# Altium schematic sheet DDS.SchDoc
size A; SheetNumber: 5; SheetTotal: 12
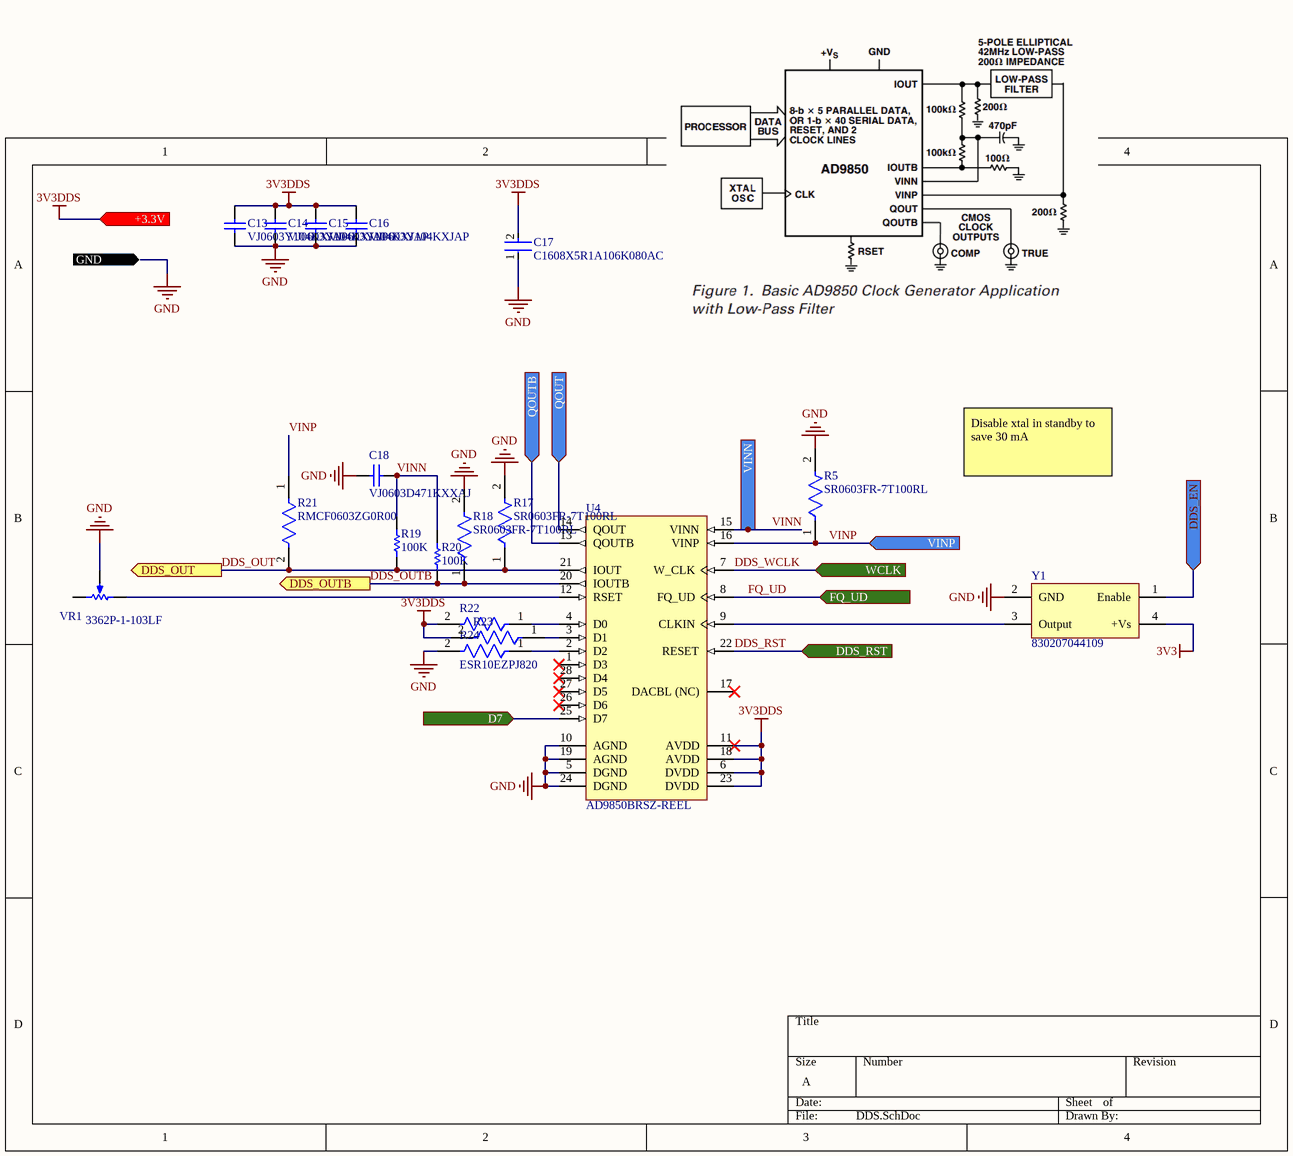
[diagram p0: DDS.SchDoc]

## Parts
C13  VJ0603Y104KXJAP  [CAPC1608X92X38NL15T08]
C14  VJ0603Y104KXJAP  [CAPC1608X92X38NL15T08]
C15  VJ0603Y104KXJAP  [CAPC1608X92X38NL15T08]
C16  VJ0603Y104KXJAP  [CAPC1608X92X38NL15T08]
C17  C1608X5R1A106K080AC  [FP-C1608-080-0_1-MFG]
C18  VJ0603D471KXXAJ  [CAPC1608X92X38LL15T08]
R5  SR0603FR-7T100RL  [FP-SR0603-MFG]
R17  SR0603FR-7T100RL  [FP-SR0603-MFG]
R18  SR0603FR-7T100RL  [FP-SR0603-MFG]
R19  100K  [RESC0603(1608)_N]
R20  100K  [RESC0603(1608)_N]
R21  RMCF0603ZG0R00  [FP-RMCF0603-IPC_B]
R22  ESR10EZPJ820  [FP-ESR10-IPC_C]  (value not drawn)
R23  ESR10EZPJ820  [FP-ESR10-IPC_C]  (value not drawn)
R24  ESR10EZPJ820  [FP-ESR10-IPC_C]
U4  AD9850BRSZ-REEL  [ADI-RS-28_N]
VR1  3362P-1-103LF  [BOUR-3362P]
Y1  830207044109  [WE-SPXO_CFPS-39]

## Ports
+3.3V (in), D7 (in), DDS_EN (in), DDS_OUT (out), DDS_OUTB (out), DDS_RST (in), FQ_UD (in), GND (in), QOUT (in), QOUTB (in), VINN (in), VINP (in), WCLK (in)

## Nets
3V3: Y1.4(+Vs)
3V3DDS: C13.2 C14.2 C15.2 C16.2 C17.2 R22.2 R23.2 U4.6(DVDD) U4.11(AVDD) U4.18(AVDD) U4.23(DVDD) ; port +3.3V
GND: C13.1 C14.1 C15.1 C16.1 C17.1 C18.2 R5.2 R17.2 R18.2 R24.2 U4.5(DGND) U4.10(AGND) U4.19(AGND) U4.24(DGND) VR1.2(S) Y1.2(GND) ; port GND
D7: U4.25(D7) ; port D7
DDS_EN: Y1.1(Enable) ; port DDS_EN
DDS_OUT: R17.1 R19.1 R21.2 U4.21(IOUT) ; port DDS_OUT
DDS_OUTB: R18.1 R20.1 U4.20(IOUTB) ; port DDS_OUTB
DDS_RST: U4.22(RESET) ; port DDS_RST
DDS_WCLK: U4.7(W_CLK) ; port WCLK
FQ_UD: U4.8(FQ_UD) ; port FQ_UD
QOUT: U4.14(QOUT) ; port QOUT
QOUTB: U4.13(QOUTB) ; port QOUTB
VINN: C18.1 R19.2 R20.2 U4.15(VINN) ; port VINN
VINP: R5.1 R21.1 U4.16(VINP) ; port VINP
NetR22_1: R22.1 U4.4(D0)
NetR23_1: R23.1 U4.3(D1)
NetR24_1: R24.1 U4.2(D2)
NetU4_9: U4.9(CLKIN) Y1.3(Output)
NetU4_12: U4.12(RSET) VR1.1(CCW)

Not connected (* = marked no-connect by the designer): U4 1(D3)* 17(DACBL_(NC))* 26(D6)* 27(D5)* 28(D4)*; VR1 3(CW)

## Notes on the sheet
- Disable xtal in standby to save 30 mA

## Library data of the parts
C13-C16 = CMP-2006-01211-1: Manufacturer: Vitramon; Part Number: VJ0603Y104KXJAP
C17 = CMP-2000-04979-3: Multilayer Ceramic Capacitors 10μF ±10% 10V X5R SMD 0603; Capacitance: 10uF; Dielectric Material: Ceramic; Construction: Flat; Height: 0.8mm; Thickness: 0.035inch; Case Code (Metric): 1608; Radiation Hardening: No; Number of Pins: 2; Voltage Rating (DC): 10V; Depth: 0.8mm; Voltage: 10V; RoHS Compliant: Yes; Voltage Rating: 10V; Package Quantity: 1; Resistor Type: Ceramic; Termination: SMD/SMT; Lead Free: Lead Free; REACH SVHC: No SVHC; Tolerance: 10%; Mount: Surface Mount; Series: C; Packaging: Tape and Reel; Width: 0.8mm; Dielectric: X5R; Weight: 7.1E-05oz; Length: 1.6mm; Max Operating Temperature: 85°C; Case Code (Imperial): 0603; Case/Package: 0603; Min Operating Temperature: -55°C
C18 = CMP-2006-01521-1: Manufacturer: Vitramon; Part Number: VJ0603D471KXXAJ
R5 R17 R18 = CMP-03412-002710-1: RES SMD 0603 1/4W 1% 100 OHM; Manufacturer: Yageo; Power Rating: 0.25W; Description: SR0603 100Ω 0.25W 1.00%; Voltage Rating: 75V; Automotive Grade: Grade 0; Resistance: 100Ω; Tolerance: 0.01; Value: 100Ω; Height: 0.55mm; Device Class L2: Resistors; RoHS: TRUE; Temperature Range High: +155°C; Device Class L3: Chip SMD Resistors; Category: Res; Device Class L1: Passive Components; Manufacturer Part Number: SR0603FR-7T100RL; Temperature Range Low: -55°C; Temperature: -55°C to +155°C; Lead Free: Yes; Octopart: https://octopart.com/sr0603fr-7t100rl-yageo-91478072; ComponentLink2URL: http://www.yageo.com/documents/recent/PYu-SR_D_F%20tol_RoHS_L_3.pdf; Series: SR; Automotive: Yes; Footprint Url: http://www.yageo.com/exep/pages/download/literatures/PYu-R_Mount_10.pdf; Package: SR0603; ComponentLink2Description: Datasheet; Composition: Thick Film; Ipc Land Pattern Name: RESC16080X45; Digikey Description: RES SMD 0603 1/4W 1% 100 OHM
R19 R20 = CMP-1012-00736-1: 100K 0.1W 1% 0603 (1608 Metric)  SMD; Value: 100000.00 Ohm; Case-Metric: 1608; Case-EIA: 0603; Power: 0.1 W; Tolerance: 1 %; Technology: SMT
R21 = CMP-26527-006412-1: 0Ω ±0 0.1W 0603 Thick Film Chip Resistor AEC-Q200 compliant; Max Power Dissipation: 100mW; Resistance: 0R; Width: 0.031inch; RoHS Compliant: Yes; Number of Terminations: 2; Case/Package: 0603; Contact Plating: Tin; Height: 0.022inch; Resistor Type: Thick Film; Mount: Surface Mount; Length: 0.061inch; Features: Automotive AEC-Q200; Series: RMCF; Max Operating Temperature: 155°C; Radiation Hardening: No; Min Operating Temperature: -55°C; Packaging: Tape and Reel
R22-R24 = CMP-08839-027843-1: 82Ω ±5% 0.4W 0805 Anti-Surge Chip Resistor AEC-Q200; Temperature Coefficient: 200ppm/°C; Resistance: 82R; Max Power Dissipation: 400mW; Power Rating: 250mW; Size Code: 0805; Tolerance: 5%; RoHS Compliant: Yes; Series: ESR; Lead Free: Lead Free; Case/Package: 0805; Number of Terminations: 2; Packaging: Cut Tape; Features: Automotive AEC-Q200; Case Code (Imperial): 0805; Case Code (Metric): 2012
U4 = CMP-0293-00041-1: CMOS, 125 MHz Complete DDS Synthesizer, 10-Bit, Parallel, Serial, RS-28, 1500 Reel, Pb-Free; Tuning Word Width (bits): 32bit; Master fclk: 125MHz; Resolution (Bits): 10bit; REFCLK Multiplier: No; Compliance Range (V): 1.5V; FS Iout (mA nom): 20mA; I Supply total (max): 96mA; ComponentLink3Description: Package Specification; Code_JEDEC: MO-150-AH; ComponentLink1URL: www.analog.com; I/O Interface: Parallel, Serial; PackageDescription: 28-Lead Shrink Small Outline Package [SSOP]; ComponentLink2URL: http://www.analog.com/static/imported-files/data_sheets/AD9850.pdf; ComponentLink3URL: http://www.analog.com/static/imported-files/packages/32122249223724RS_28.pdf; ComponentLink2Description: Datasheet; PackageVersion: revA, 1997; ComponentLink1Description: Manufacturer URL; PackageReference: RS-28; DatasheetVersion: Rev. H
VR1 = CMP-1747-00004-1: Square Trimpot(R) Trimming Potentiometer, 10 KOhm, 300 V, -55 to 125 degC, 3-Pin THD, RoHS, Tube; Voltage Rating: 220 mV; Power Rating: 1 W; Tolerance: 1%; Resistance: 50 mohm; Case/Package: 1206; Length: 3.2 mm; RoHSCompliant: True; PackageDescription: 3-Pin Through Hole Device, Body 6.6 x 6.99 mm, Pitch 2.54 mm; ComponentLink2Description: Datasheet; REACH SVHC: No SVHC; Mount: Surface Mount; Height: 0.6 mm; Packaging: Tape and Reel; ComponentLink1URL: http://www.bourns.com/; Case Code (Imperial): 0612; Pins: 2; Case Code (Metric): 1632; ComponentLink2URL: http://www.bourns.com/docs/Product-Datasheets/3362.pdf; Min Operating Temperature: -25degC; ComponentLink1Description: Manufacturer URL; PackageReference: 3326P; Max Operating Temperature: 125degC; Width: 1.6 mm; Package Quantity: 5000; DatasheetVersion: May-16
Y1 = CMP-03913-116855802-1: 830207044109 WE-SPXO Crystal Oscillator; Frequency: 100MHz; NexarPartId: 116855802; Length: 3.2mm; Width: 2.5mm; Max Operating Temperature: 85°C; Height: 1.2mm; Min Operating Temperature: -40°C